# EAGLE design Bridge_PCA9517 (EAGLE 6.3)
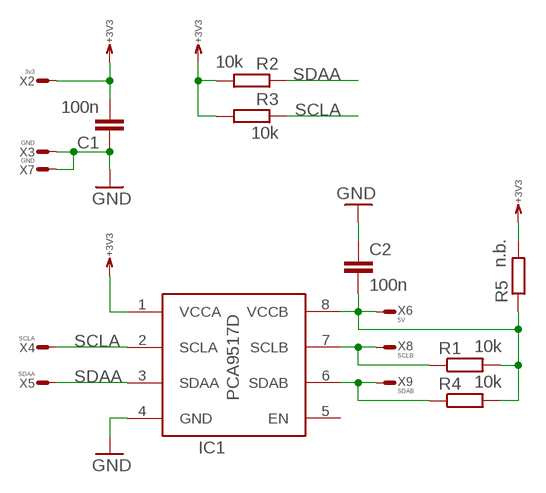
[diagram p0: schematic, sheet 1]

## Parts
C1  100n  C0603  [0603]
C2  100n  C0603  [0603]
IC1  PCA9517D  [SOIC8]
R1  10k  R0603  [0603]
R2  10k  R0603  [0603]
R3  10k  R0603  [0603]
R4  10k  R0603  [0603]
R5  n.b.  R0603  [0603]
X2  3v3  WIREPADT1.6/0.9  [T1.6/0.9]
X3  GND  WIREPADT1.6/0.9  [T1.6/0.9]
X4  SCLA  WIREPADT1.6/0.9  [T1.6/0.9]
X5  SDAA  WIREPADT1.6/0.9  [T1.6/0.9]
X6  5V  WIREPADT1.6/0.9  [T1.6/0.9]
X7  GND  WIREPADT1.6/0.9  [T1.6/0.9]
X8  SCLB  WIREPADT1.6/0.9  [T1.6/0.9]
X9  SDAB  WIREPADT1.6/0.9  [T1.6/0.9]

## Nets
+3V3: C1.2 IC1.1(VCCA) R2.2 R3.2 R5.2 X2.1(S)
GND: C1.1 C2.1 IC1.4(GND) X3.1(S) X7.1(S)
N$3: C2.2 IC1.8(VCCB) R1.2 R4.2 R5.1 X6.1(S)
SCLA: IC1.2(SCLA) R3.1 X4.1(S)
SCLB: IC1.7(SCLB) R1.1 X8.1(S)
SDAA: IC1.3(SDAA) R2.1 X5.1(S)
SDAB: IC1.6(SDAB) R4.1 X9.1(S)
Unconnected: IC1.5(EN)

## Library data of the parts
C1 C2 = RCL:C: Capacitor SMD
IC1 = Other:PCA9517
R1-R5 = RCL:R: Resistor SMD
X2-X9 = Conn:WIREPAD: Wire PAD connect wire on PCB

## Board
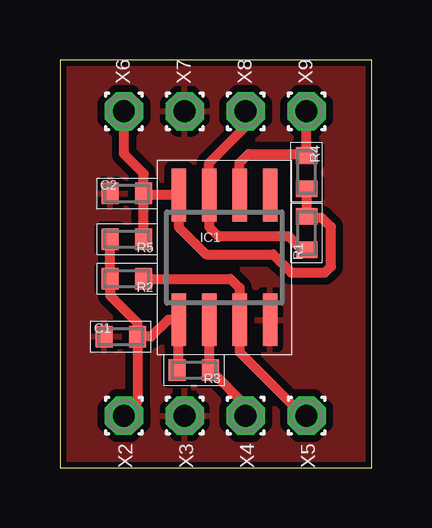
[diagram p1: board, top side]
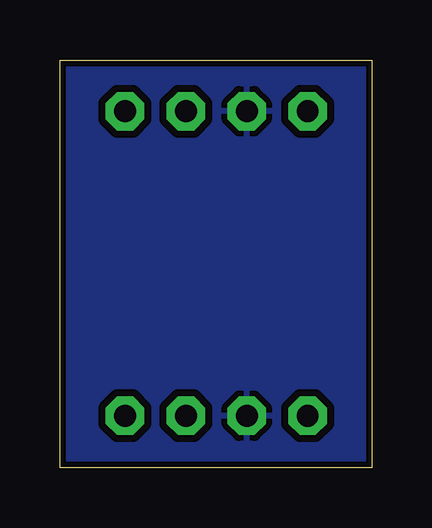
[diagram p2: board, bottom side, seen from below]

Size 13 x 17 mm. Coordinates in mm from the lower left corner, seen from the top.
Outline: 0,0 13,0 13,17 0,17 0,0
Copper layers (1*16): Top 0.035mm / dielectric 1.5mm / Bottom 0.035mm
Design rules "default": minimum track width 10mil, minimum drill 12mil, track to track 12mil, track to pad 12mil, pad to pad 12mil, via to via 12mil, smd to smd 12mil, copper to edge 10mil, drill to drill 8mil, minimum pad ring 10mil, minimum via ring 8mil, stop-mask expansion 4mil, vias tented up to drill 0mil, thermal gap 10mil

### Footprints (pad centres in the part's own frame; a part is rotated, then mirrored left to right if it is on the bottom)
0603 = smd 0.7 x 0.9: 1 -0.697,0; 2 0.697,0
SOIC8 = smd 0.6 x 2.2: 1 -1.905,-2.6; 2 -0.635,-2.6; 3 0.635,-2.6; 4 1.905,-2.6; 5 1.905,2.6; 6 0.635,2.6; 7 -0.635,2.6; 8 -1.905,2.6
T1.6/0.9 = drill 0.914 pad 1.6 octagon: 1 0,0

### Placement (x,y rotation side)
C1  2.54,5.46 0 top
C2  2.79,11.43 0 top
IC1  6.86,8.76 0 top
R1  10.29,9.78 90 top
R2  2.79,7.87 180 top
R3  5.59,4.06 180 top
R4  10.29,12.32 270 top
R5  2.79,9.53 180 top
X2  2.67,2.16 270 top
X3  5.21,2.16 270 top
X4  7.75,2.16 270 top
X5  10.29,2.16 270 top
X6  2.67,14.86 90 top
X7  5.21,14.86 90 top
X8  7.75,14.86 90 top
X9  10.29,14.86 90 top

### Tracks (layer width: path | path; a pad name or v marks a point on that pad's centre or on a via)
+3V3
  Top 0.406: C1.2 3.24,6.03 2.1,7.17 R2.2 R5.2 | C1.2 3.24,2.73 X2.1 | C1.2 3.81,5.46 4.51,6.16 IC1.1 4.95,4.13 R3.2
GND
  pour Top: 0,17 13,17 13,0 0,0
  pour Bottom: 0,0 13,0 13,17 0,17
N$3
  Top 0.406: R4.2 R1.2 10.35,10.41 10.92,10.41 11.3,10.03 11.3,8.38 11.05,8.13 9.65,8.13 8.89,8.89 6.1,8.89 4.95,10.03 IC1.8 3.56,11.36 C2.2 | C2.2 3.49,12.26 2.67,13.08 X6.1 | R5.1 C2.2
SCLA
  Top 0.406: IC1.2 6.22,4.13 R3.1 7.75,2.6 X4.1
SCLB
  Top 0.406: X8.1 7.75,14.22 6.22,12.7 IC1.7 6.22,10.03 6.6,9.65 9.53,9.65 10.03,9.14 10.22,9.14 R1.1
SDAA
  Top 0.406: X5.1 10.16,2.16 7.49,4.83 7.49,6.1 IC1.3 7.49,7.49 7.11,7.87 R2.1
SDAB
  Top 0.406: IC1.6 7.49,12.7 7.87,13.08 10.22,13.08 R4.1 X9.1